# EAGLE design badge_03v2_2layer (EAGLE 7.2.0)
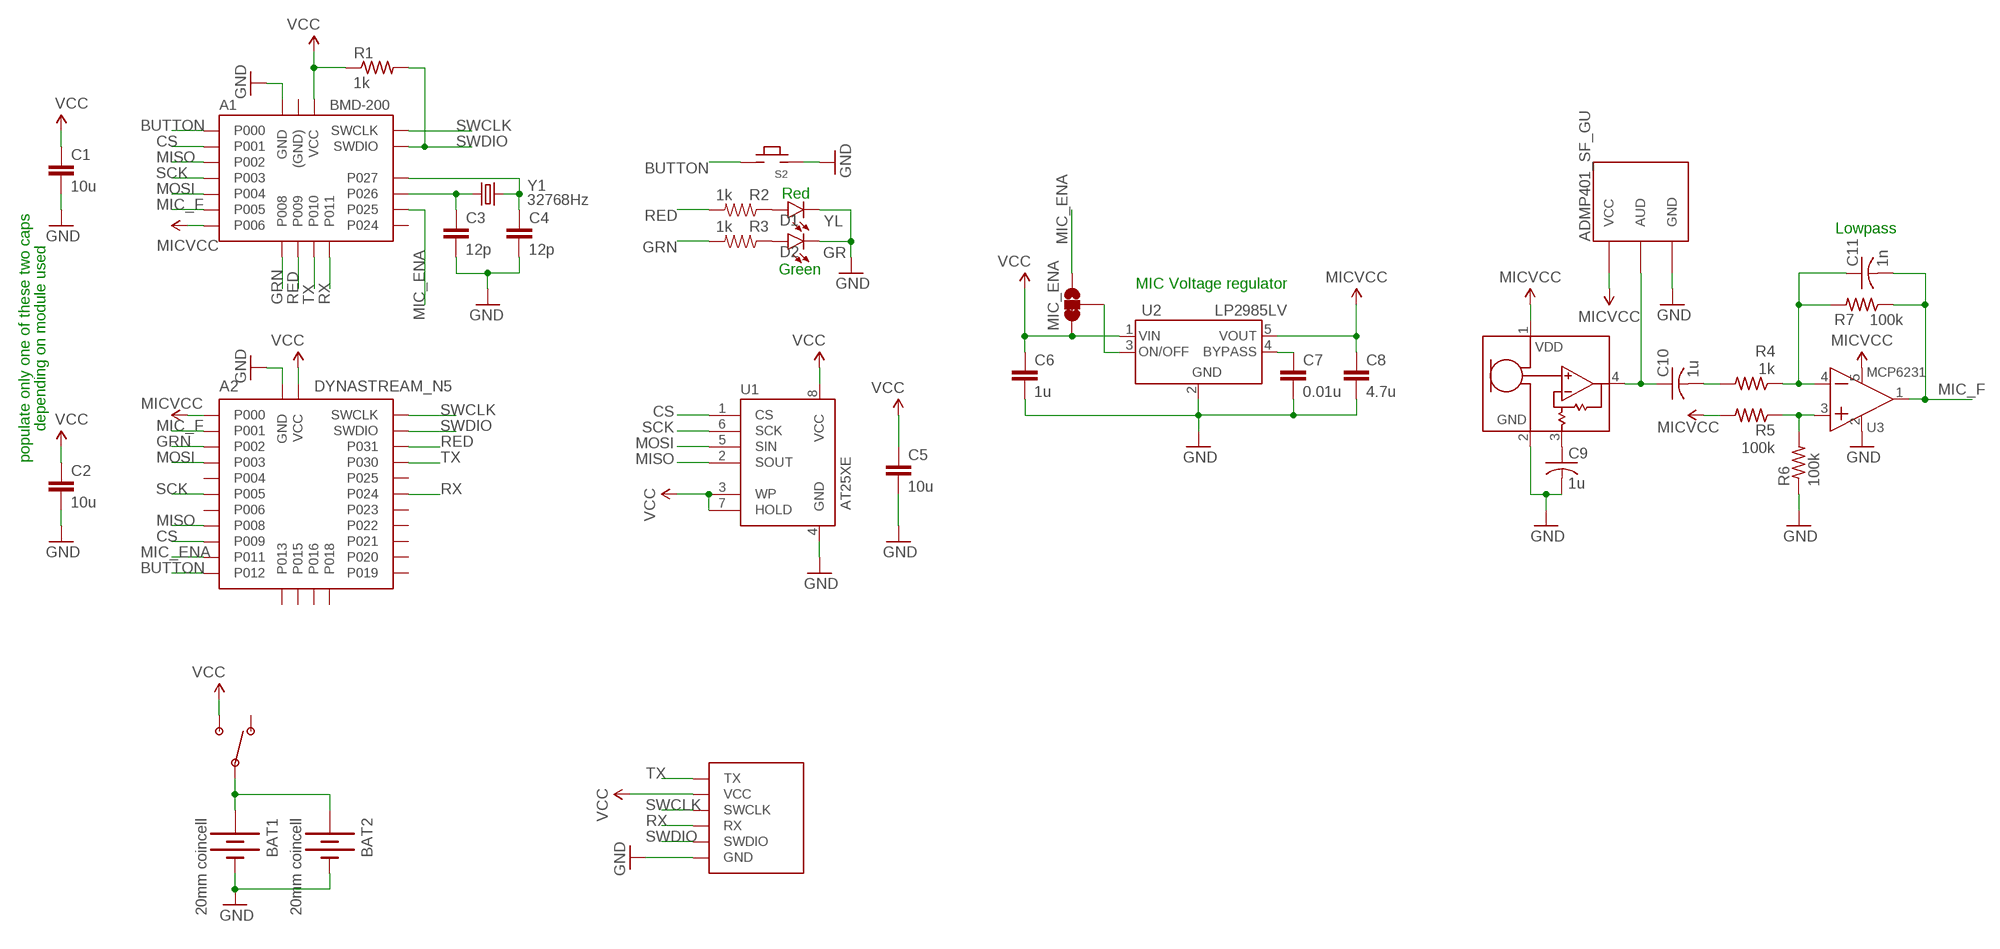
[diagram p0: schematic, sheet 1]

## Parts
A1  BMD-200  [BMD-200]
A2  DYNASTREAM_N5  [DYNASTREAM_N5]
A3  ADMP401_SF_GU  [ADMP401_SF_SMD]
BAT1  20mm coincell  BATTERY20MM_ISO  [BATTCON_20MM_4LEGS_ISO]
BAT2  20mm coincell  BATTERY20MM_ISO_NOCREAM  [BATTCON_20MM_4LEGS_ISO_NOCREAM]
C1  10u  C-EUC0603  [C0603]
C2  10u  C-EUC0603  [C0603]
C3  12p  C-EUC0603  [C0603]
C4  12p  C-EUC0603  [C0603]
C5  10u  C-EUC0603  [C0603]
C6  1u  C-EUC0603  [C0603]
C7  0.01u  C-EUC0603  [C0603]
C8  4.7u  C-EUC0603  [C0603]
C9  1u  C-USC0603  [C0603]
C10  1u  C-USC0603  [C0603]
C11  1n  C-USC0603  [C0603]
D1  YL  LED  [LED-0603]
D2  GR  LED  [LED-0603]
J1  PROG_CONN_6  [TH_CONN_6]
MIC_ENA  DC/DC  JUMPER-PAD-3-2OF3_NC_BY_TRACE_SMALL  [PAD-JUMPER-3-2OF3_NC_BY_TRACE_YES_SILK_FULL_BOX]
MK1  SPU0414(AMP)  [MIC_SPU041X]
R1  1k  R-US_R0603  [R0603]
R2  1k  RESISTOR0603-RES  [0603-RES]
R3  1k  RESISTOR0603-RES  [0603-RES]
R4  1k  R-US_R0603  [R0603]
R5  100k  R-US_R0603  [R0603]
R6  100k  R-US_R0603  [R0603]
R7  100k  R-US_R0603  [R0603]
S1  CL-SB-12A-01  [CL-SB-12A-01]
S2  TACT6MM4  [TACT1]
U1  AT25XE  AT25_SOIC  [SOIC8]
U2  LP2985LV  [SOT23-5L]
U3  MCP6231  [SOT23-5L]
Y1  32768Hz  CRYSTAL  [CRYSTAL_2SMD]

## Nets
BUTTON: A1.P$11(P000) A2.D1(P012) S2.1 S2.2
CS: A1.P$12(P001) A2.E1(P009) U1.1(CS)
GND: A1.P$1(GND) A1.P$2(GND) A1.P$3(GND) A1.P$4(GND) A1.P$7(GND) A1.P$10(GND) A1.P$19(GND) A1.P$26(GND) A2.A2(GND) A2.A3(GND) A2.A4(GND) A2.A5(GND) A2.A6(GND) A3.GND A3.GNDT(GND) BAT1.NEG(-) BAT2.NEG(-) C1.2 C2.2 C3.2 C4.2 C5.2 C6.2 C7.2 C8.2 C9.2 D1.C D2.C J1.GND MK1.2(GND) R6.1 S2.3 S2.4 U1.4(GND) U2.2(GND) U3.2(GND)
GRN: A1.P$20(P008) A2.F5(P002) R3.2
MIC_ENA: A1.P$6(P025) A2.E2(P011) MIC_ENA.1
MIC_F: A1.P$16(P005) A2.F4(P001) C11.2 R7.1 U3.1(O)
MICVCC: A1.P$17(P006) A2.E5(P000) A3.VCC A3.VCCT(VCC) C8.1 MK1.1(VDD) R5.2 U2.5(VOUT) U3.5(VDD)
MISO: A1.P$13(P002) A2.F1(P008) U1.2(SOUT)
MOSI: A1.P$15(P004) A2.F3(P003) U1.5(SIN)
N$2: A1.P$8(P026) C3.1 Y1.P$2
N$3: D1.A R2.1
N$4: D2.A R3.1
N$6: MIC_ENA.2 U2.3(ON/OFF)
N$7: C9.1 MK1.3(GAIN)
N$8: A1.P$9(P027) C4.1 Y1.P$1
N$9: C7.1 U2.4(BYPASS)
N$10: R5.1 R6.2 U3.3(+)
N$11: A3.AUD A3.AUDT(AUD) C10.1 MK1.4(OUT)
N$13: C10.2 R4.2
N$14: C11.1 R4.1 R7.2 U3.4(-)
RED: A1.P$21(P009) A2.F6(P031) R2.2
RX: A1.P$23(P011) A2.D6(P024) J1.RX
SCK: A1.P$14(P003) A2.F2(P005) U1.6(SCK)
SWCLK: A1.P$25(SWCLK) A2.C1(SWCLK) J1.SWCLK
SWDIO: A1.P$24(SWDIO) A2.B1(SWDIO) J1.SWDIO R1.2
TX: A1.P$22(P010) A2.E6(P030) J1.TX
VBATT: BAT1.1(+) BAT1.2(+) BAT1.3(+) BAT1.4(+) BAT2.1(+) BAT2.2(+) BAT2.3(+) BAT2.4(+) S1.C
VCC: A1.P$18(VCC) A2.B5(VCC) A2.B6(VCC) A2.C5(VCC) A2.C6(VCC) C1.1 C2.1 C5.1 C6.1 J1.VCC MIC_ENA.3 R1.1 S1.2 U1.3(WP) U1.7(HOLD) U1.8(VCC) U2.1(VIN)
Unconnected: A1.P$5(P024) A1.P$27((GND)) A1.P$28((GND)) A2.B2(P018) A2.B3(P020) A2.B4(P019) A2.C2(P013) A2.C3(P016) A2.C4(P022) A2.D2(P015) A2.D3(P025) A2.D4(P023) A2.D5(P021) A2.E3(P006) A2.E4(P004) S1.1

## Notes on the sheet
- Red
- Lowpass
- Green
- MIC Voltage regulator
- depending on module used
- populate only one of these two caps

## Library data of the parts
A1 = rigado_BMD-200:BMD-200
A2 = dynastreamN5:DYNASTREAM_N5
A3 = Badge:ADMP401_SF: Sparkfun MEMS mic breakout Module includes MEMS mic and 67x gain amp, output biased to 1/2 VDD. Footprint includes TH and SMD male header pads; 2 packages differ in the orientation of the SMD pads.
BAT1 BAT2 = Badge:BATTERY: Battery Holders Various common sizes : AA, AAA, 18650 (PRT-12895), 20mm coin cell and 12mm coin cell. 20MM_4LEGS, BATT-10373
C1-C8 = rcl:C-EU: CAPACITOR, European symbol
C9-C11 = rcl:C-US: CAPACITOR, American symbol
D1 D2 = Badge:LED
J1 = Badge:PROG_CONN_6
MIC_ENA = Badge:JUMPER-PAD-3-2OF3_NC_BY_TRACE
MK1 = Badge:SPU0414(AMP)
R1 R4-R7 = rcl:R-US_: RESISTOR, American symbol
R2 R3 = SparkFun-Passives:RESISTOR: Resistor Basic schematic elements and footprints for 0603, 1206, and PTH resistors.
S1 = Badge:CL-SB-12
S2 = Badge:TACT
U1 = Badge:AT25
U2 = Badge:LP2985LV
U3 = Badge:MCP6231
Y1 = Badge:CRYSTAL

## Board
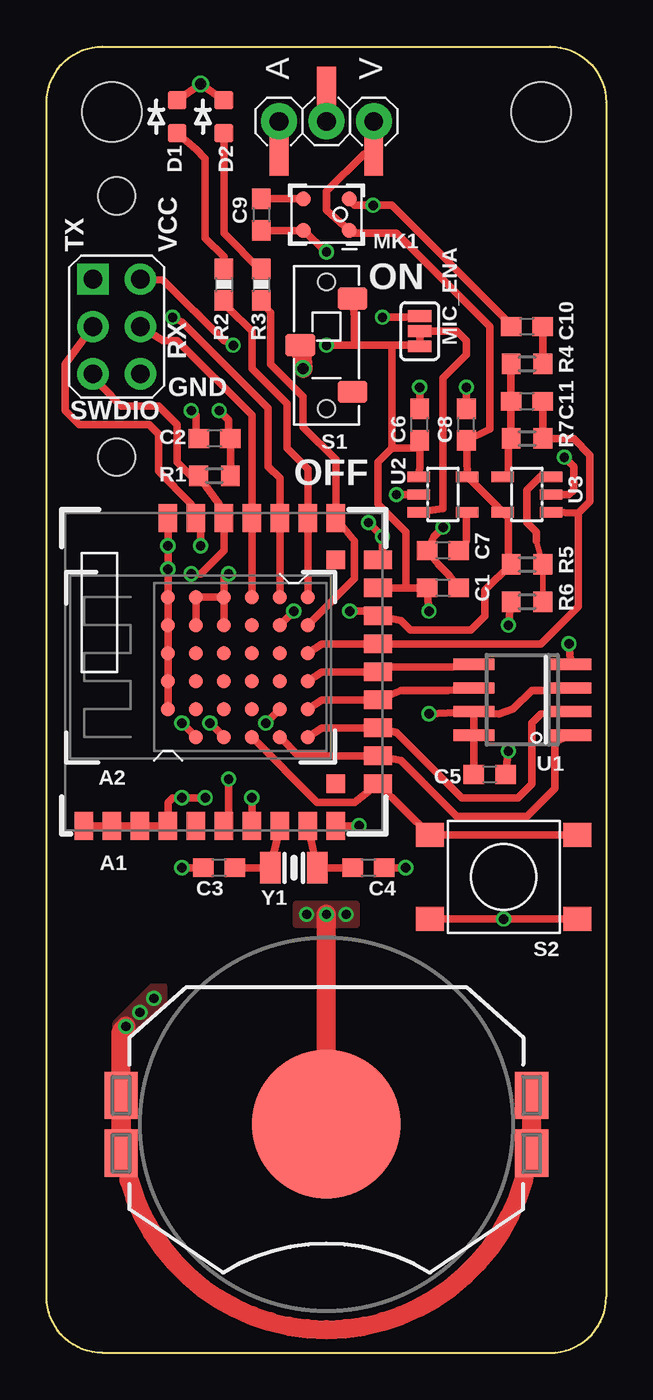
[diagram p1: board, top side]
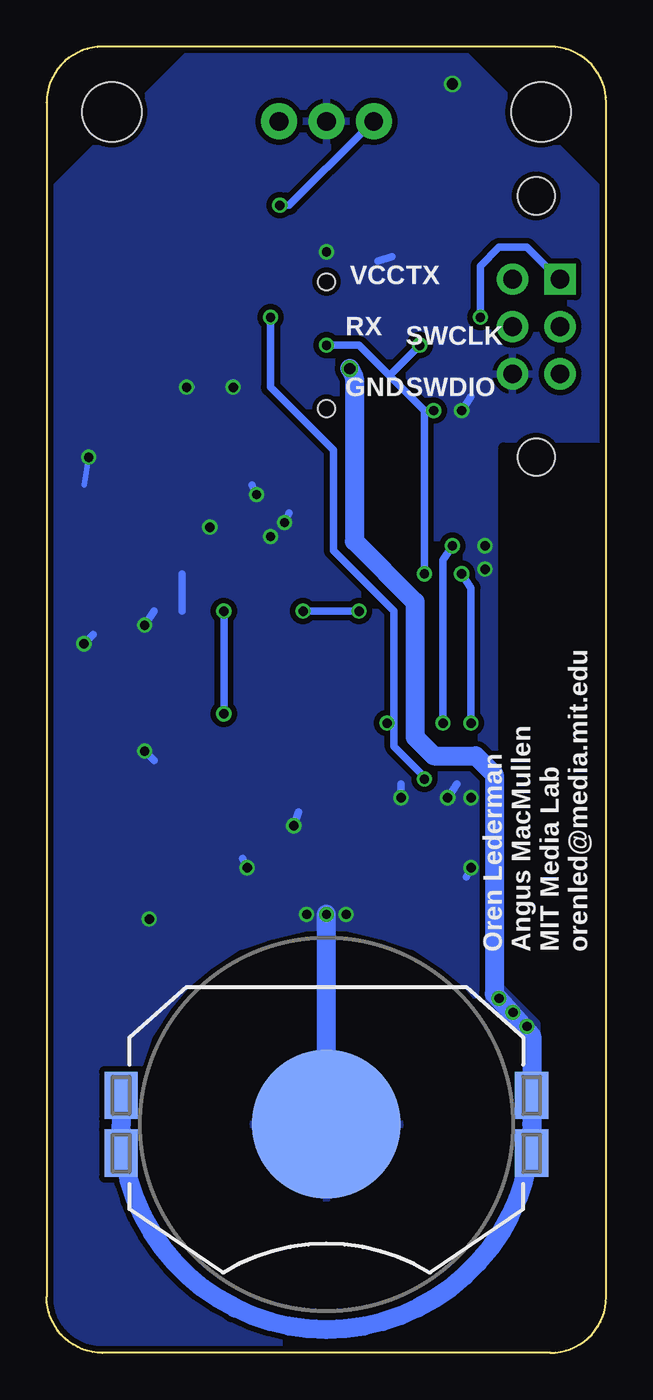
[diagram p2: board, bottom side, seen from below]

Size 30 x 70 mm. Coordinates in mm from the lower left corner, seen from the top.
Outline: 3,0 27,0 arc90 30,3 30,67 arc90 27,70 3,70 arc90 0,67 0,3 arc90 3,0
Copper layers (1*16): Top 0.035mm / dielectric 1.5mm / Bottom 0.035mm
Design rules "ITEADstudio_DRC - oren": minimum track width 6mil, minimum drill 12mil, track to track 6mil, track to pad 6mil, pad to pad 6mil, via to via 6mil, smd to smd 0mil, copper to edge 10mil, drill to drill 10mil, minimum pad ring 10mil, minimum via ring 6mil, stop-mask expansion 2mil, vias tented up to drill 100mil, thermal gap 10mil
Holes 2 mm at 3.75,48 3.75,62
Holes 3.2 mm at 3.5,66.5 26.5,66.5

### Footprints (pad centres in the part's own frame; a part is rotated, then mirrored left to right if it is on the bottom)
BMD-200 = smd 1.5 x 1: P$1 -8.25,7.5; P$2 -8.25,6; P$3 -8.25,4.5; P$4 -8.25,3; P$5 -8.25,1.5; P$6 -8.25,0; P$7 -8.25,-1.5; P$8 -8.25,-3; P$9 -8.25,-4.5; P$10 -8.25,-6; P$20 8.25,-6; P$21 8.25,-4.5; P$22 8.25,-3; P$23 8.25,-1.5; P$24 8.25,0; P$25 8.25,1.5; P$26 8.25,3 | smd 1 x 1.5: P$11 -6,-8.25; P$12 -4.5,-8.25; P$13 -3,-8.25; P$14 -1.5,-8.25; P$15 0,-8.25; P$16 1.5,-8.25; P$17 3,-8.25; P$18 4.5,-8.25; P$19 6,-8.25 | smd 1 x 1: P$27 -6,-6; P$28 6,-6
DYNASTREAM_N5 = smd 0.762 x 0.762: A2 1.5,0; A3 3,0; A4 4.5,0; A5 6,0; A6 7.5,0; B1 0,-1.5; B2 1.5,-1.5; B3 3,-1.5; B4 4.5,-1.5; B5 6,-1.5; B6 7.5,-1.5; C1 0,-3; C2 1.5,-3; C3 3,-3; C4 4.5,-3; C5 6,-3; C6 7.5,-3; D1 0,-4.5; D2 1.5,-4.5; D3 3,-4.5; D4 4.5,-4.5; D5 6,-4.5; D6 7.5,-4.5; E1 0,-6; E2 1.5,-6; E3 3,-6; E4 4.5,-6; E5 6,-6; E6 7.5,-6; F1 0,-7.5; F2 1.5,-7.5; F3 3,-7.5; F4 4.5,-7.5; F5 6,-7.5; F6 7.5,-7.5
ADMP401_SF_SMD = smd 1 x 2.51: AUD -2.54,-1.66; GND 0,1.66; VCC 2.54,-1.66 | drill 1 pad 1.93: AUDT -2.54,0; GNDT 0,0; VCCT 2.54,0
BATTCON_20MM_4LEGS_ISO = smd 1.778 x 2.54: 1 -11,1.55; 2 -11,-1.55; 3 11,1.55; 4 11,-1.55 | smd 8 x 8: NEG 0,0
BATTCON_20MM_4LEGS_ISO_NOCREAM = smd 1.778 x 2.54: 1 -11,1.55; 2 -11,-1.55; 3 11,1.55; 4 11,-1.55 | smd 8 x 8: NEG 0,0
C0603 = smd 1.1 x 1: 1 -0.85,0; 2 0.85,0
LED-0603 = smd 1 x 1: A 0,-0.877; C 0,0.877
TH_CONN_6 = drill 1 pad 1.676: GND 1.27,-2.54; RX 1.27,0; SWCLK -1.27,0; SWDIO -1.27,-2.54; VCC 1.27,2.54 | drill 1 pad 1.676 square: TX -1.27,2.54
PAD-JUMPER-3-2OF3_NC_BY_TRACE_YES_SILK_FULL_BOX = smd 0.635 x 1.27: 1 -0.813,0; 2 0,0; 3 0.813,0
MIC_SPU041X = smd 0.8 x 0.8: 1 0.85,1.23; 2 0.85,-1.23; 3 -0.85,-1.23; 4 -0.85,1.23
R0603 = smd 1 x 1.1: 1 -0.85,0; 2 0.85,0
0603-RES = smd 1.1 x 1: 1 -0.85,0; 2 0.85,0
CL-SB-12A-01 = smd 1.2 x 1.6: 1 -2.5,-1.4; 2 2.5,-1.4; C 0,1.4 | hole 0.9: -3.4,0; 3.4,0
TACT1 = smd 1.5 x 1.3: 1 -3.95,2.25; 2 3.95,2.25; 3 -3.95,-2.25; 4 3.95,-2.25
SOIC8 = smd 0.6 x 2.2: 1 -1.905,-2.6; 2 -0.635,-2.6; 3 0.635,-2.6; 4 1.905,-2.6; 5 1.905,2.6; 6 0.635,2.6; 7 -0.635,2.6; 8 -1.905,2.6
SOT23-5L = smd 0.55 x 1.2: 1 -0.95,-1.3; 2 0,-1.3; 3 0.95,-1.3; 4 0.95,1.3; 5 -0.95,1.3
CRYSTAL_2SMD = smd 1.1 x 1.7: P$1 -1.25,0; P$2 1.25,0

### Placement (x,y rotation side)
A1  9.5,36.5 90 top
A2  6.5,33 90 top
A3  15,66 0 top
BAT1  15,12.25 0 top
BAT2  15,12.25 0 bottom
C1  21.25,41 0 top
C2  9,49 180 top
C3  9.25,26 180 top
C4  17.25,26 0 top
C5  23.75,31 0 top
C6  20,49.75 90 top
C7  21.25,43 180 top
C8  22.5,49.75 90 top
C9  11.5,61 270 top
C10  25.75,55 0 top
C11  25.75,51 0 top
D1  7,66.25 0 top
D2  9.5,66.25 0 top
J1  3.75,55 0 top
MIC_ENA  20,54.75 270 top
MK1  15,61 270 top
R1  9,47 180 top
R2  9.5,57.25 270 top
R3  11.5,57.25 270 top
R4  25.75,53 0 top
R5  25.75,42.25 180 top
R6  25.75,40.25 0 top
R7  25.75,49 180 top
S1  15,54 90 top
S2  24.5,25.5 0 top
U1  25.5,35 90 top
U2  21.25,46 270 top
U3  25.75,46 90 top
Y1  13.25,26 180 top

### Tracks (layer width: path | path; a pad name or v marks a point on that pad's centre or on a via)
BUTTON
  Top 0.406: A2.D1 14.5,29.5 16.5,29.5 A1.P$11 S2.1 S2.2
CS
  Top 0.406: A2.E1 13.5,32 A1.P$12 19,31.75 22,28.75 25.75,28.75 27.25,30.25 27.25,32.75 U1.1
GND  (via drill 0.5, 0.6)
  Top 0.305: A3.GND A3.GNDT
  Top 0.406: U3.2 28,46 28.25,46.25 28.25,47.5 v27.75,48 | C3.2 v7.25,26 | A1.P$7 v11,29.75 | A1.P$10 v16.75,28.25 | C4.2 v19.25,26 | A1.P$1 A1.P$2 A1.P$3 A1.P$4 6.5,29.5 6.75,29.75 v7.25,29.75 v8.5,29.75 | R6.1 v24.75,39 | A1.P$19 18,43 v18,43.75 v17.25,44.5 | A1.P$26 v6.5,43.25 v6.5,42 A2.A6 A2.A5 A2.A4 A2.A3 A2.A2 | C6.2 v20,51.75 | C8.2 v22.5,51.75 | U2.2 v18.75,46 | D1.C v8.25,68 D2.C | v15,59 MK1.2 C9.2 | C5.2 v24.75,32.25 | U1.4 v28,38 | S2.4 v24.5,23.25 S2.3 | C2.2 8,49.5 8,50.25 v7.75,50.5 | v21.25,44.25 20.75,43.75 C7.2 21,42.25 21.5,41.75 C1.2
  Top 1.016: BAT2.NEG v15,23.5
  Bottom 0.305: v27.75,48 28,46.5
  Bottom 0.406: v7.25,26 7.5,25.5 | v11,29.75 11,30.5 | v16.75,28.25 16.5,29 | v19.25,26 19.5,26.5 | v24.75,39 24.25,39.75 | 22.75,41.75 22.75,39.75 | v17.25,44.5 17,45 | v8.5,29.75 8,30.5 | 11.5,58.75 12.25,58.5 | v20,51.75 20,52 | v22.5,51.75 22.25,51.75 | v18.75,46 19,46.5 | v24.75,32.25 24.25,31.75 | v28,38 27.5,38.5 | v7.75,50.5 7.25,51.25
  Bottom 1.016: BAT2.NEG v15,23.5
  other vias: 16.06,23.5 13.94,23.5
  pour Bottom (isolate 0.3, rank 2): 0,62 0,0 30,0 30,62 22,70 8,70
  pour Top: 13.41,22.97 13.41,24.03 16.59,24.03 16.59,22.97
GRN
  Top 0.406: R3.2 12,55.75 12,53 13.75,51.25 13.75,49.62 15.5,47.88 A1.P$20 16.5,43.5 16.5,41.5 A2.F5
MIC_ENA  (via drill 0.5)
  Top 0.406: A1.P$6 9.75,29 v9.75,30.75 | MIC_ENA.1 19.25,55.5 v18,55.5 | A2.E2 v11.75,33.75
  Bottom 0.406: v9.75,30.75 9.88,31 11.38,32.5 11.38,33.25 11.38,33.75 | v18,55.5 18,51.75 14.62,48.38 14.62,43 11.38,39.75 11.38,33.75 | v11.75,33.75 11.38,33.75
MIC_F
  Top 0.305: 26.88,49 R7.1
  Top 0.406: C11.2 R7.1 | U3.1 28.5,45 | 28.5,45 29.12,45.62 29.12,48.12 28.25,49 26.88,49 | 28.5,45 28.5,40 26.5,38 A1.P$16 14.75,38 A2.F4
MICVCC  (via drill 0.5)
  Top 0.406: A3.VCCT A3.VCC 17,64.25 15,62.25 15,61.25 MK1.1 16.5,60 18.75,60 23.75,55 23.75,49.5 C8.1 U2.5 U3.5 24.75,44.75 24.75,42.75 R5.2 23.5,40.88 23.5,39.5 22.75,38.75 19.5,38.75 19,39.25 A1.P$17 17.5,39.75 v16.25,39.75 | A2.E5 v13.25,39.75
  Bottom 0.406: v13.25,39.75 v16.25,39.75
MISO
  Top 0.406: A2.F1 14.75,33.5 A1.P$13 18.75,33.25 22.25,29.75 25.25,29.75 26,30.5 26,33.75 26.5,34.25 U1.2
MOSI
  Top 0.406: A2.F3 14.75,36.5 A1.P$15 18.5,36.75 21.75,36.75 U1.5
N$2
  Top 0.406: A1.P$8 Y1.P$2 C3.1
N$3
  Top 0.406: R2.1 9.5,58.75 8.5,59.75 8.5,64 8,64.5 D1.A
N$4
  Top 0.406: D2.A 9.5,60 11.5,58 R3.1
N$6
  Top 0.406: U2.3 21.25,45.25 21.25,52.25 22.5,53.5 22.5,54.25 22,54.75 MIC_ENA.2
N$7
  Top 0.406: MK1.3 C9.1
N$8
  Top 0.406: A1.P$9 Y1.P$1 C4.1
N$9
  Top 0.406: U2.4 22.5,44.75 22.5,43.5 C7.1
N$10
  Top 0.305: R6.2 R5.1 26.25,43.5 | U3.3 26.5,47
  Top 0.406: 26.5,47 25.75,46.25 25.75,44.5 26.25,44 26.25,43.5
N$11  (via drill 0.5)
  Top 0.305: A3.AUD A3.AUDT
  Top 0.406: MK1.4 16.5,61.5 v17.5,61.5 18.5,61.5 24.75,55.25 C10.1
  Bottom 0.406: A3.AUDT 13,65.5 17,61.5 v17.5,61.5
N$13
  Top 0.406: C10.2 R4.2
N$14
  Top 0.305: R7.2 24.75,48.5 | 24.75,47.25 U3.4
  Top 0.406: R4.1 C11.1 R7.2 | 24.75,48.5 24.75,47.25
RED
  Top 0.406: R2.2 9.75,56 11,54.75 11,52.75 12.88,50.88 12.88,48.5 14,47.38 A1.P$21 A2.F6
RX
  Top 0.406: J1.RX 6.25,54.25 7,54.25 11,50.25 A1.P$23 A2.D6
SCK
  Top 0.406: A2.F2 14.75,35 A1.P$14 19,35.5 21.5,35.5 U1.6
SWCLK  (via drill 0.5)
  Top 0.406: J1.SWCLK 1,53 1,50.5 1.75,49.75 5.5,49.75 6,49.25 6,47.25 7.75,45.5 A1.P$25 8.25,44 v8.25,43.25 | v8.75,33.75 A2.C1
  Bottom 0.406: v8.25,43.25 8.75,42.5 v8.75,33.75
SWDIO  (via drill 0.5)
  Top 0.406: J1.SWDIO 3,51.75 4,50.75 6,50.75 7,49.75 7,47.75 7.75,47 R1.2 9.25,45.5 A1.P$24 9.5,43 8.25,41.75 v7.75,41.75 | A2.B1 v7.25,33.75
  Bottom 0.406: v7.25,33.75 7.25,41 v7.75,41.75
TX  (via drill 0.5)
  Top 0.406: v6.75,55.5 7.25,55.25 11.88,50.62 11.88,47.5 12.5,46.88 A1.P$22 A2.E6
  Bottom 0.406: v6.75,55.5 6.75,58.25 5.75,59.25 4.25,59.25 3,58 J1.TX
VBATT  (via drill 0.5, 0.6)
  Top 1.016: S1.C v13.75,52.75 | BAT2.3 4,12.25 arc90 15,1.25 arc90 26,12.25 | 26,12.25 BAT2.1 | BAT2.2 26,12.25 | BAT2.3 4,17.25 | 4,17.25 arc90 v4.25,17.5 4,17.25 | BAT2.4 BAT2.3
  Bottom 1.016: v13.75,52.75 13.5,52.25 13.5,43.5 10.25,40.25 10.25,33 9.25,32 7,32 6,31 6,19.25 4,17 BAT2.3 4,12.25 | 4,12.25 arc90 15,1.25 arc90 26,12.25 | BAT2.1 26,12.25 | BAT2.2 26,12.25 | 4,12.25 BAT2.4
  other vias: 5,18.25 5.75,19
  pour Bottom (isolate 0.254): 4,17 4,17.5 6,19.5 6,19
  pour Top: 4,17 4,17.5 6,19.5 6,19
VCC  (via drill 0.5)
  Top 0.406: A1.P$18 19.25,41 | 19.25,41 C1.1 v20.5,39.75 | 19.25,41 19.25,44 17.75,45.5 17.75,47.75 18.5,48.5 | U2.1 20,47.5 C6.1 19.75,48.5 18.5,48.5 | 18.5,54 18.5,48.5 | 18.5,54 19.25,54 MIC_ENA.3 | 16.5,54 18.5,54 | J1.VCC 6.25,57.5 9.5,54.25 v10,54 | U1.3 26.75,35.5 26,35.5 25,34.5 24.25,34.25 U1.7 | A2.B5 A2.B6 A2.C6 | A2.C5 A2.C6 | A2.C6 9.5,41.5 v9.75,41.75 | v20.5,34.25 U1.7 | U1.7 U1.8 C5.1 | v15,54 16.5,54 | 16.5,54 16.5,55.5 S1.2 | R1.1 C2.1 9.75,49.5 9.75,50 v9.25,50.5
  Bottom 0.406: 9.75,50.5 11.62,52.38 | 11.62,52.38 13.25,54 v15,54 | v10,54 11.62,52.38 | v9.75,41.75 9.75,50.5 | v9.25,50.5 9.75,50.5 | v20.5,34.25 v20.5,39.75

### Text on the board
tPlace: TX | VCC | ON | RX | GND | SWDIO | OFF
bPlace: TX | VCC | SWCLK | RX | SWDIO | GND | Oren Lederman / Angus MacMullen / MIT Media Lab / orenled@media.mit.edu